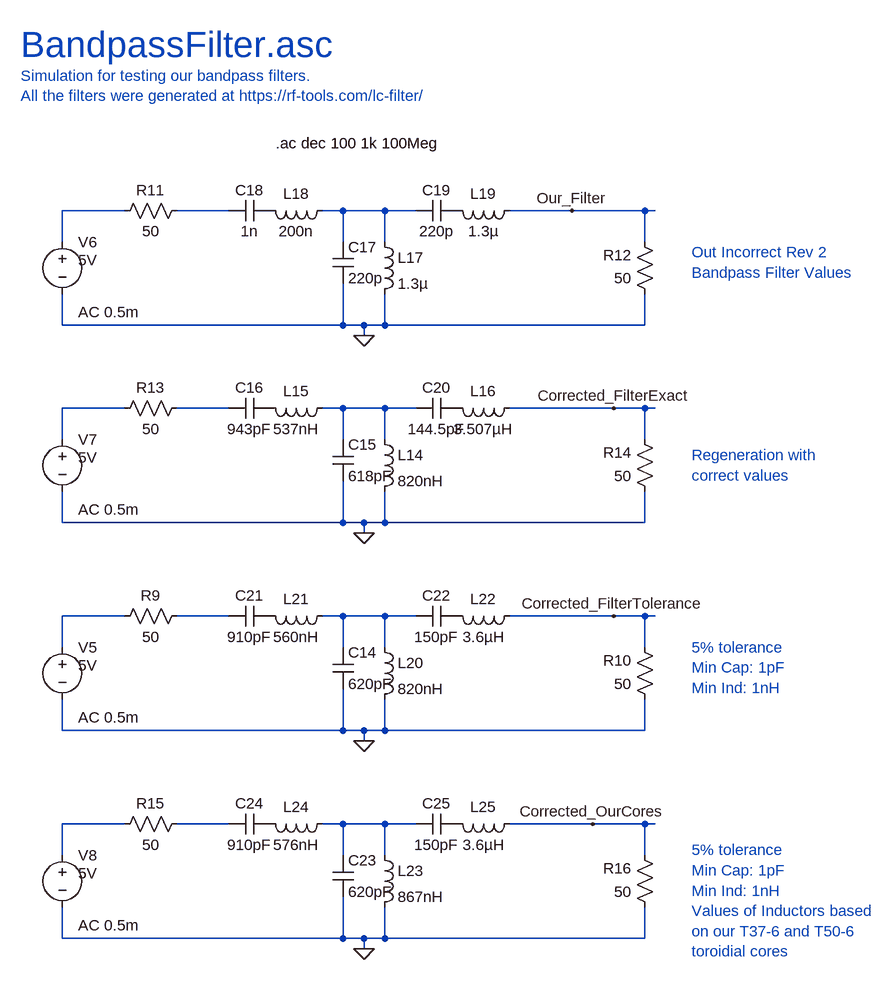
[diagram p0: schematic BandpassFilter.asc]
BandpassFilter.asc, the LTspice schematic file:
Version 4
SHEET 1 2168 1412
WIRE 16 64 -80 64
WIRE 176 64 96 64
WIRE 352 64 320 64
WIRE 416 64 352 64
WIRE 464 64 416 64
WIRE 704 64 608 64
WIRE 816 64 704 64
WIRE 832 64 816 64
WIRE -80 112 -80 64
WIRE 352 112 352 64
WIRE 416 112 416 64
WIRE 816 112 816 64
WIRE -80 240 -80 192
WIRE 352 240 352 176
WIRE 352 240 -80 240
WIRE 384 240 352 240
WIRE 416 240 416 192
WIRE 416 240 384 240
WIRE 816 240 816 192
WIRE 816 240 416 240
WIRE 384 256 384 240
WIRE 16 368 -80 368
WIRE 176 368 96 368
WIRE 352 368 320 368
WIRE 416 368 352 368
WIRE 464 368 416 368
WIRE 768 368 608 368
WIRE 816 368 768 368
WIRE 832 368 816 368
WIRE -80 416 -80 368
WIRE 352 416 352 368
WIRE 416 416 416 368
WIRE 816 416 816 368
WIRE -80 544 -80 496
WIRE 352 544 352 480
WIRE 352 544 -80 544
WIRE 384 544 352 544
WIRE 416 544 416 496
WIRE 416 544 384 544
WIRE 816 544 816 496
WIRE 816 544 416 544
WIRE 384 560 384 544
WIRE 16 688 -80 688
WIRE 176 688 96 688
WIRE 352 688 320 688
WIRE 416 688 352 688
WIRE 464 688 416 688
WIRE 768 688 608 688
WIRE 816 688 768 688
WIRE 832 688 816 688
WIRE -80 736 -80 688
WIRE 352 736 352 688
WIRE 416 736 416 688
WIRE 816 736 816 688
WIRE -80 864 -80 816
WIRE 352 864 352 800
WIRE 352 864 -80 864
WIRE 384 864 352 864
WIRE 416 864 416 816
WIRE 416 864 384 864
WIRE 816 864 816 816
WIRE 816 864 416 864
WIRE 384 880 384 864
WIRE 16 1008 -80 1008
WIRE 176 1008 96 1008
WIRE 352 1008 320 1008
WIRE 416 1008 352 1008
WIRE 464 1008 416 1008
WIRE 736 1008 608 1008
WIRE 816 1008 736 1008
WIRE 832 1008 816 1008
WIRE -80 1056 -80 1008
WIRE 352 1056 352 1008
WIRE 416 1056 416 1008
WIRE 816 1056 816 1008
WIRE -80 1184 -80 1136
WIRE 352 1184 352 1120
WIRE 352 1184 -80 1184
WIRE 384 1184 352 1184
WIRE 416 1184 416 1136
WIRE 416 1184 384 1184
WIRE 816 1184 816 1136
WIRE 816 1184 416 1184
WIRE 384 1200 384 1184
FLAG 384 560 0
FLAG 384 256 0
FLAG 384 880 0
FLAG 704 64 Our_Filter
FLAG 768 688 Corrected_FilterTolerance
FLAG 384 1200 0
FLAG 736 1008 Corrected_OurCores
FLAG 768 368 Corrected_FilterExact
SYMBOL voltage -80 400 R0
WINDOW 123 24 124 Left 2
WINDOW 39 0 0 Left 0
WINDOW 3 24 44 Left 2
SYMATTR Value2 AC 0.5m
SYMATTR Value 5V
SYMATTR InstName V7
SYMBOL res 112 352 R90
WINDOW 0 0 56 VBottom 2
WINDOW 3 32 56 VTop 2
SYMATTR InstName R13
SYMATTR Value 50
SYMBOL cap 336 416 R0
SYMATTR InstName C15
SYMATTR Value 618pF
SYMBOL ind 400 400 R0
SYMATTR InstName L14
SYMATTR Value 820nH
SYMBOL res 832 512 R180
WINDOW 0 36 76 Left 2
WINDOW 3 36 40 Left 2
SYMATTR InstName R14
SYMATTR Value 50
SYMBOL cap 240 352 R90
WINDOW 0 0 32 VBottom 2
WINDOW 3 32 32 VTop 2
SYMATTR InstName C16
SYMATTR Value 943pF
SYMBOL ind 336 352 R90
WINDOW 0 5 56 VBottom 2
WINDOW 3 32 56 VTop 2
SYMATTR InstName L15
SYMATTR Value 537nH
SYMBOL cap 528 352 R90
WINDOW 0 0 32 VBottom 2
WINDOW 3 32 32 VTop 2
SYMATTR InstName C20
SYMATTR Value 144.5pF
SYMBOL ind 624 352 R90
WINDOW 0 5 56 VBottom 2
WINDOW 3 32 56 VTop 2
SYMATTR InstName L16
SYMATTR Value 3.507µH
SYMBOL voltage -80 96 R0
WINDOW 123 24 124 Left 2
WINDOW 39 0 0 Left 0
WINDOW 3 24 44 Left 2
SYMATTR Value2 AC 0.5m
SYMATTR Value 5V
SYMATTR InstName V6
SYMBOL res 112 48 R90
WINDOW 0 0 56 VBottom 2
WINDOW 3 32 56 VTop 2
SYMATTR InstName R11
SYMATTR Value 50
SYMBOL cap 336 112 R0
SYMATTR InstName C17
SYMATTR Value 220p
SYMBOL ind 400 96 R0
SYMATTR InstName L17
SYMATTR Value 1.3µ
SYMBOL res 832 208 R180
WINDOW 0 36 76 Left 2
WINDOW 3 36 40 Left 2
SYMATTR InstName R12
SYMATTR Value 50
SYMBOL cap 240 48 R90
WINDOW 0 0 32 VBottom 2
WINDOW 3 32 32 VTop 2
SYMATTR InstName C18
SYMATTR Value 1n
SYMBOL ind 336 48 R90
WINDOW 0 5 56 VBottom 2
WINDOW 3 32 56 VTop 2
SYMATTR InstName L18
SYMATTR Value 200n
SYMBOL cap 528 48 R90
WINDOW 0 0 32 VBottom 2
WINDOW 3 32 32 VTop 2
SYMATTR InstName C19
SYMATTR Value 220p
SYMBOL ind 624 48 R90
WINDOW 0 5 56 VBottom 2
WINDOW 3 32 56 VTop 2
SYMATTR InstName L19
SYMATTR Value 1.3µ
SYMBOL voltage -80 720 R0
WINDOW 123 24 124 Left 2
WINDOW 39 0 0 Left 0
WINDOW 3 24 44 Left 2
SYMATTR Value2 AC 0.5m
SYMATTR Value 5V
SYMATTR InstName V5
SYMBOL res 112 672 R90
WINDOW 0 0 56 VBottom 2
WINDOW 3 32 56 VTop 2
SYMATTR InstName R9
SYMATTR Value 50
SYMBOL cap 336 736 R0
SYMATTR InstName C14
SYMATTR Value 620pF
SYMBOL ind 400 720 R0
SYMATTR InstName L20
SYMATTR Value 820nH
SYMBOL res 832 832 R180
WINDOW 0 36 76 Left 2
WINDOW 3 36 40 Left 2
SYMATTR InstName R10
SYMATTR Value 50
SYMBOL cap 240 672 R90
WINDOW 0 0 32 VBottom 2
WINDOW 3 32 32 VTop 2
SYMATTR InstName C21
SYMATTR Value 910pF
SYMBOL ind 336 672 R90
WINDOW 0 5 56 VBottom 2
WINDOW 3 32 56 VTop 2
SYMATTR InstName L21
SYMATTR Value 560nH
SYMBOL cap 528 672 R90
WINDOW 0 0 32 VBottom 2
WINDOW 3 32 32 VTop 2
SYMATTR InstName C22
SYMATTR Value 150pF
SYMBOL ind 624 672 R90
WINDOW 0 5 56 VBottom 2
WINDOW 3 32 56 VTop 2
SYMATTR InstName L22
SYMATTR Value 3.6µH
SYMBOL voltage -80 1040 R0
WINDOW 123 24 124 Left 2
WINDOW 39 0 0 Left 0
WINDOW 3 24 44 Left 2
SYMATTR Value2 AC 0.5m
SYMATTR Value 5V
SYMATTR InstName V8
SYMBOL res 112 992 R90
WINDOW 0 0 56 VBottom 2
WINDOW 3 32 56 VTop 2
SYMATTR InstName R15
SYMATTR Value 50
SYMBOL cap 336 1056 R0
SYMATTR InstName C23
SYMATTR Value 620pF
SYMBOL ind 400 1040 R0
SYMATTR InstName L23
SYMATTR Value 867nH
SYMBOL res 832 1152 R180
WINDOW 0 36 76 Left 2
WINDOW 3 36 40 Left 2
SYMATTR InstName R16
SYMATTR Value 50
SYMBOL cap 240 992 R90
WINDOW 0 0 32 VBottom 2
WINDOW 3 32 32 VTop 2
SYMATTR InstName C24
SYMATTR Value 910pF
SYMBOL ind 336 992 R90
WINDOW 0 5 56 VBottom 2
WINDOW 3 32 56 VTop 2
SYMATTR InstName L24
SYMATTR Value 576nH
SYMBOL cap 528 992 R90
WINDOW 0 0 32 VBottom 2
WINDOW 3 32 32 VTop 2
SYMATTR InstName C25
SYMATTR Value 150pF
SYMBOL ind 624 992 R90
WINDOW 0 5 56 VBottom 2
WINDOW 3 32 56 VTop 2
SYMATTR InstName L25
SYMATTR Value 3.6µH
TEXT 248 -40 Left 2 !.ac dec 100 1k 100Meg
TEXT 888 128 Left 2 ;Out Incorrect Rev 2\nBandpass Filter Values
TEXT 888 440 Left 2 ;Regeneration with \ncorrect values
TEXT 888 736 Left 2 ;5% tolerance\nMin Cap: 1pF\nMin Ind: 1nH
TEXT -144 -192 Left 5 ;BandpassFilter.asc
TEXT -144 -144 Left 2 ;Simulation for testing our bandpass filters.\nAll the filters were generated at https://rf-tools.com/lc-filter/
TEXT 888 1048 Left 2 ;5% tolerance\nMin Cap: 1pF\nMin Ind: 1nH\nValues of Inductors based\non our T37-6 and T50-6\ntoroidial cores

The netlist it stands for:
* BandpassFilter.asc
V7 N004 0 5V AC 0.5m
R13 N005 N004 50
C15 N006 0 618pF
L14 N006 0 820nH
R14 0 Corrected_FilterExact 50
C16 P001 N005 943pF
L15 N006 P001 537nH
C20 P002 N006 144.5pF
L16 Corrected_FilterExact P002 3.507µH
V6 N001 0 5V AC 0.5m
R11 N002 N001 50
C17 N003 0 220p
L17 N003 0 1.3µ
R12 0 Our_Filter 50
C18 P003 N002 1n
L18 N003 P003 200n
C19 P004 N003 220p
L19 Our_Filter P004 1.3µ
V5 N007 0 5V AC 0.5m
R9 N008 N007 50
C14 N009 0 620pF
L20 N009 0 820nH
R10 0 Corrected_FilterTolerance 50
C21 P005 N008 910pF
L21 N009 P005 560nH
C22 P006 N009 150pF
L22 Corrected_FilterTolerance P006 3.6µH
V8 N010 0 5V AC 0.5m
R15 N011 N010 50
C23 N012 0 620pF
L23 N012 0 867nH
R16 0 Corrected_OurCores 50
C24 P007 N011 910pF
L24 N012 P007 576nH
C25 P008 N012 150pF
L25 Corrected_OurCores P008 3.6µH
.ac dec 100 1k 100Meg
* Out Incorrect Rev 2
* Bandpass Filter Values
* Regeneration with
* correct values
* 5% tolerance
* Min Cap: 1pF
* Min Ind: 1nH
* BandpassFilter.asc
* Simulation for testing our bandpass filters.
* All the filters were generated at https://rf-tools.com/lc-filter/
* 5% tolerance
* Min Cap: 1pF
* Min Ind: 1nH
* Values of Inductors based
* on our T37-6 and T50-6
* toroidial cores
.backanno
.end